# Altium schematic sheet EFuse_12V.SchDoc
size A4; SheetNumber: 12; SheetTotal: 12
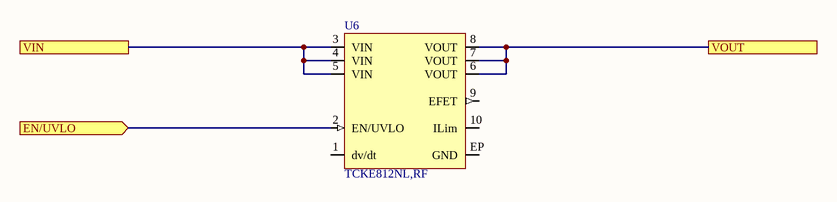
[diagram p0: EFuse_12V.SchDoc]

## Parts
U6  TCKE812NL,RF  [WSON10B-Toshiba]

## Ports
EN/UVLO (in), VIN, VOUT

## Nets
EN/UVLO: U6.2(EN/UVLO) ; port EN/UVLO
VIN: U6.3(VIN) U6.4(VIN) U6.5(VIN) ; port VIN
VOUT: U6.6(VOUT) U6.7(VOUT) U6.8(VOUT) ; port VOUT

Not connected (* = marked no-connect by the designer): U6 1(dv/dt) 9(EFET) 10(ILim) EP(GND)

## Library data of the parts
U6 = CMP-00024-00020-A01: Fuse IC with Adjustable Over Current Protection and Reverse Current Blocking FET Control; Supply Voltage (Min): 4.4V; Supply Voltage (Max): 18V; Source Current (Max): 5A; Case/Package: WSON10; Mounting Technology: SMT; Operating Temperature (Min): -55°C; Pins: 10; Operating Temperature (Max): 150°C; RoHS Compliant: Yes